# Altium schematic sheet Voltage_Reference_Circuit.SchDoc
size 431 x 279 mm; Organization: ORGANIZATION; Address1: ADDRESS 1; Address2: ADDRESS 2; Address3: ADDRESS 3; Address4: ADDRESS 4; Revision: -; SheetNumber: 5; SheetTotal: 6; ENG_APP_DATE: --/--/--; DSN_APP_DATE: --/--/--; CHK_APP_DATE: --/--/--
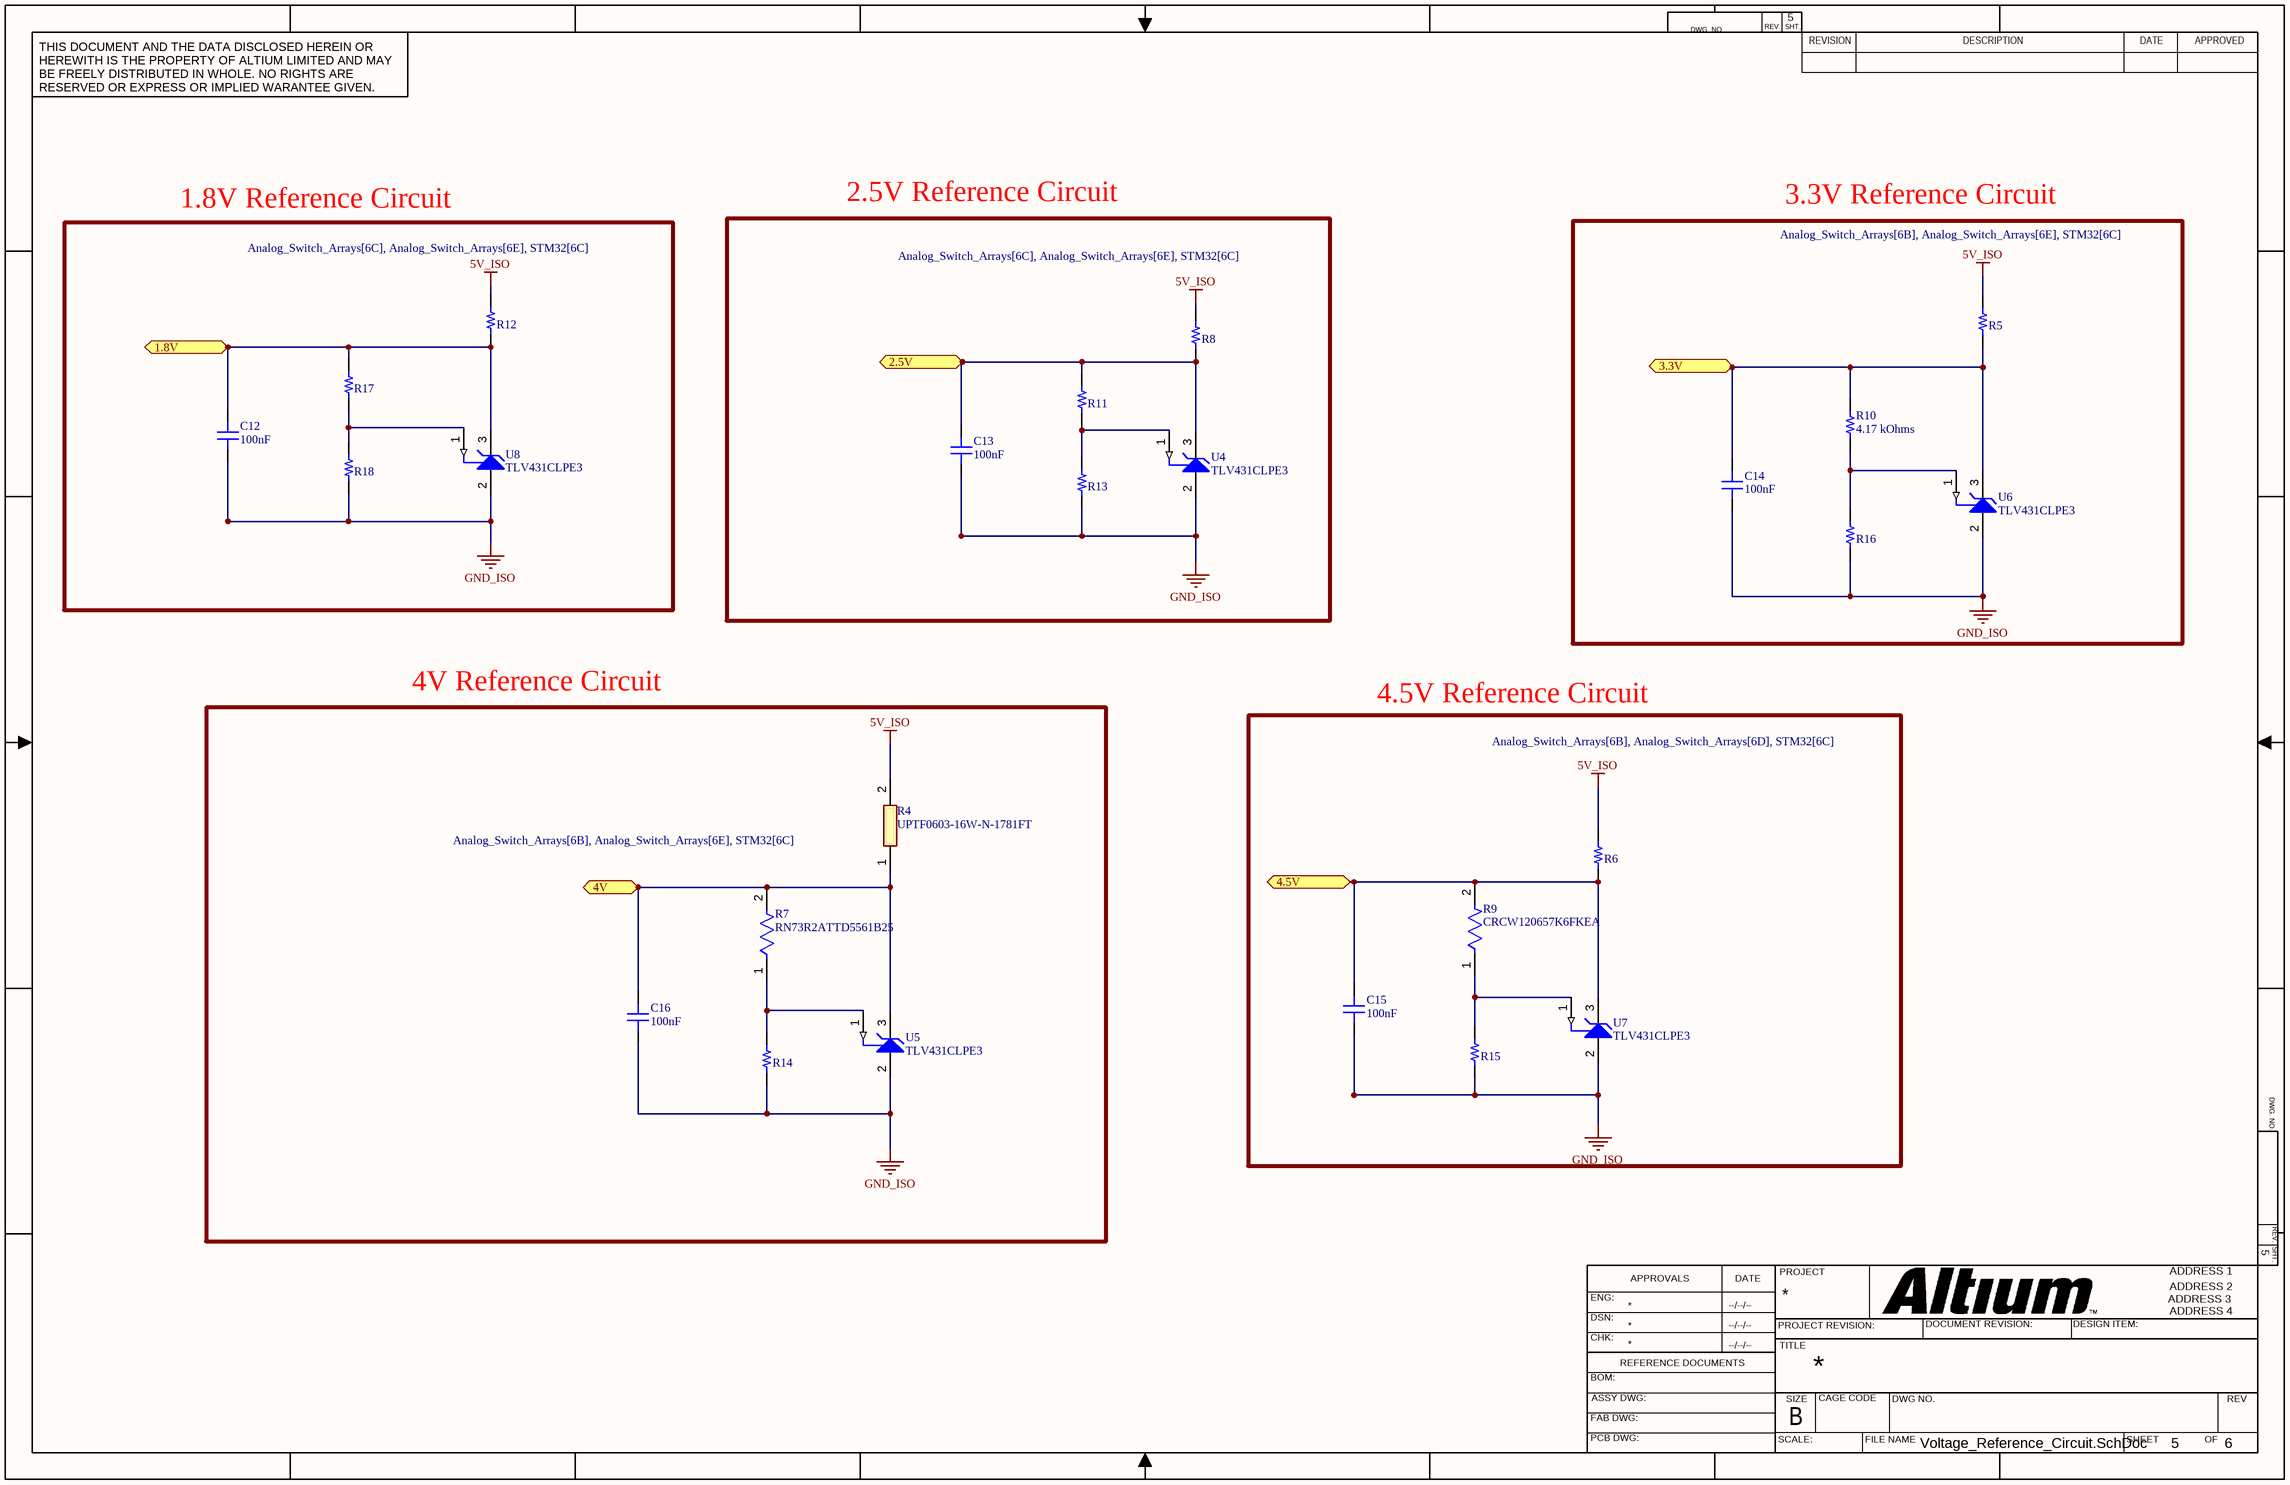
[diagram p0: Voltage_Reference_Circuit.SchDoc]

## Parts
C12  value 100nF  [CAP 1206_3216 - 0.8MM]  (hidden comment: VJ1206Y104KXXAC)
C13  value 100nF  [CAP 1206_3216 - 0.8MM]  (hidden comment: VJ1206Y104KXXAC)
C14  value 100nF  [CAP 1206_3216 - 0.8MM]  (hidden comment: VJ1206Y104KXXAC)
C15  value 100nF  [CAP 1206_3216 - 0.8MM]  (hidden comment: VJ1206Y104KXXAC)
C16  value 100nF  [CAP 1206_3216 - 0.8MM]  (hidden comment: VJ1206Y104KXXAC)
R4  UPTF0603-16W-N-1781FT  [RESC1608X55N]
R5  RQ73C2B1K69BTD  [RES 1206_3216]  (value not drawn)
R6  RT1206BRD07442RL  [YAGEO RES 1206_3216]  (value not drawn)
R7  RN73R2ATTD5561B25  [FP-RN73R2A-IPC_C]
R8  KTR18EZPF2491  [RES 1206_3216]  (value not drawn)
R9  CRCW120657K6FKEA  [FP-CRCW1206-e3-IPC_B]
R10  value 4.17 kOhms  [KOA RES RK73 RN73 0603_1608]  (hidden comment: RN73R1JTTD4171B25)
R11  RT1206BRD072K55L  [YAGEO RES 1206_3216]  (value not drawn)
R12  KTR18EZPF2491  [RES 1206_3216]  (value not drawn)
R13  KTR18EZPF2491  [RES 1206_3216]  (value not drawn)
R14  KTR18EZPF2491  [RES 1206_3216]  (value not drawn)
R15  KTR18EZPF2491  [RES 1206_3216]  (value not drawn)
R16  KTR18EZPF2491  [RES 1206_3216]  (value not drawn)
R17  RK73H2BTTD1131F  [RES 1206_3216]  (value not drawn)
R18  KTR18EZPF2491  [RES 1206_3216]  (value not drawn)
U4  TLV431CLPE3  [TI-LP3]
U5  TLV431CLPE3  [TI-LP3]
U6  TLV431CLPE3  [TI-LP3]
U7  TLV431CLPE3  [TI-LP3]
U8  TLV431CLPE3  [TI-LP3]

## Blocks framed on the sheet
2.5V Reference Circuit: C13 R8 R11 R13 U4
1.8V Reference Circuit: C12 R12 R17 R18 U8
3.3V Reference Circuit: C14 R5 R10 R16 U6
4V Reference Circuit: C16 R4 R7 R14 U5
4.5V Reference Circuit: C15 R6 R9 R15 U7

## Ports
1.8V (bidir, see Analog_Switch_Arrays[6C], Analog_Switch_Arrays[6E], STM32[6C]), 2.5V (bidir, see Analog_Switch_Arrays[6C], Analog_Switch_Arrays[6E], STM32[6C]), 3.3V (bidir, see Analog_Switch_Arrays[6B], Analog_Switch_Arrays[6E], STM32[6C]), 4.5V (bidir, see Analog_Switch_Arrays[6B], Analog_Switch_Arrays[6D], STM32[6C]), 4V (bidir, see Analog_Switch_Arrays[6B], Analog_Switch_Arrays[6E], STM32[6C])

## Nets
5V_ISO: R4.2 R5.2 R6.2 R8.2 R12.2
GND_ISO: C12.1 C13.1 C14.1 C15.1 C16.1 R13.1 R14.1 R15.1 R16.1 R18.1 U4.2(ANODE) U5.2(ANODE) U6.2(ANODE) U7.2(ANODE) U8.2(ANODE)
1.8V: C12.2 R12.1 R17.2 U8.3(CATHODE) ; port 1.8V
2.5V: C13.2 R8.1 R11.2 U4.3(CATHODE) ; port 2.5V
3.3V: C14.2 R5.1 R10.2 U6.3(CATHODE) ; port 3.3V
4.5V: C15.2 R6.1 R9.2 U7.3(CATHODE) ; port 4.5V
4V: C16.2 R4.1 R7.2 U5.3(CATHODE) ; port 4V
NetR7_1: R7.1 R14.2 U5.1(REF)
NetR9_1: R9.1 R15.2 U7.1(REF)
NetR10_1: R10.1 R16.2 U6.1(REF)
NetR11_1: R11.1 R13.2 U4.1(REF)
NetR17_1: R17.1 R18.2 U8.1(REF)

## Notes on the sheet
- DWG. NO.
- REV.
- SHT.
- THIS DOCUMENT AND THE DATA DISCLOSED HEREIN OR HEREWITH IS THE PROPERTY OF ALTIUM LIMITED AND MAY BE FREELY DISTRIBUTED IN WHOLE. NO RIGHTS ARE RESERVED OR EXPRESS OR IMPLIED WARANTEE GIVEN.
- REVISION
- DESCRIPTION
- DATE
- APPROVED
- ENG:
- APPROVALS
- PROJECT
- DSN:
- CHK:
- REFERENCE DOCUMENTS
- PROJECT REVISION:
- TITLE
- DOCUMENT REVISION:
- DESIGN ITEM:
- BOM:
- FAB DWG:
- PCB DWG:
- ASSY DWG:
- SCALE:
- SIZE
- B
- CAGE CODE
- FILE NAME
- DWG NO.
- SHEET
- OF
- REV

## Library data of the parts
C12-C16 = CMP-001-062189-1: CAP CER 0.1UF 25V X7R 1206; Part Number: VJ1206Y104KXXAC
R4 = UPTF0603-16W-N-1781FT: Resistor; Manufacturer_Name: Venkel; Datasheet Link: https://page.venkel.com/hubfs/Resources/Datasheets/UPTF-Series.pdf; Height: 0.55mm; Manufacturer_Part_Number: UPTF0603-16W-N-1781FT
R5 = CMP-009-075815-1: RES 1.69 KOHMS 0.1% 0.4W 1206; Part Number: RQ73C2B1K69BTD
R6 = CMP-009-090039-1: RES SMD 442 OHM 0.1% 1/4W 1206; Part Number: RT1206BRD07442RL
R7 = CMP-04015-006256-1: 5.56kΩ ±0.1% 0.125W, 1/8W Chip Resistor 0805 (2012 Metric) Moisture Resistant Thin Film
R8 R12-R16 R18 = CMP-009-080149-1: RES SMD 2.49K OHM 1% 1/4W 1206; Part Number: KTR18EZPF2491
R9 = CMP-2003-02290-2: RES Thick Film, 57.6kΩ, 1%, 0.25W, 100ppm/°C, 1206; Resistance: 57.6kR; Power Rating: 250mW; Voltage Rating: 200V; Number of Pins: 2; Case/Package: 1206; Max Operating Temperature: 155°C; Min Operating Temperature: -55°C; Case Code (Imperial): 1206; Case Code (Metric): 3216; Temperature Coefficient: 100ppm/°C; Features: Automotive AEC-Q200; Packaging: Tape and Reel; Number of Terminations: 2; Military Standard: Not; Length: 3.2mm; Weight: 0.000353oz; Height: 0.55mm; Width: 0.063inch; Height - Seated (Max): 0.024inch; Voltage Rating (DC): 200V; Radiation Hardening: No; Composition: Thick Film; Package Quantity: 5000; Contact Plating: Tin; Tolerance: 1%; Lead Free: Lead Free; Max Power Dissipation: 250mW; Depth: 1.6mm
R10 = CMP-009-044138-1: RES 4.17K OHM 0.1% 1/10W 0603; Part Number: RN73R1JTTD4171B25
R11 = CMP-009-083477-1: RES SMD 2.55K OHM 0.1% 1/4W 1206; Part Number: RT1206BRD072K55L
R17 = CMP-009-082226-1: RES 1.13K OHM 1% 1/4W 1206; Part Number: RK73H2BTTD1131F
U4-U8 = CMP-0366-00210-1: Low Voltage Adjustable Precision Shunt Regulator, 39 ppm / degC, 15 mA, 0 to 70 degC, 3-pin TO-92 (LP), Pb-Free (RoHS); Manufacturer: Texas Instruments; Eco-Plan: Green (RoHS & no Sb/Br); Iout/Iz(Max)(mA): 15; VO Adj(Max)(V): 6; Min Iz for Regulation(uA): 80; SubFamily: Shunt Voltage Reference; VO Adj(Min)(V): 1.24; Rating: Catalog; Temp Coeff(Typ)(ppm/ degree C): 39; Initial Accuracy @ 25/deg C(%): 1.5; Temp Coeff(Max)(ppm/ degree C): 129; PackageReference: LP3; PackageDescription: Plastic Cylindrical Package, Formed Lead Option (TO-92); ComponentLink2URL: http://www.ti.com/general/docs/lit/getliterature.tsp?genericPartNumber=TLV431&fileType=pdf; ComponentLink2Description: Datasheet; ComponentLink3Description: Package Specification; ComponentLink1URL: http://www.ti.com/; PartNumber: TLV431CLPE3; PackageVersion: 4040001-2/C; Code_JEDEC: TO-226; ComponentLink3URL: http://www.ti.com/litv/pdf/msot002a; DatasheetVersion: SLVS139T; ComponentLink1Description: Manufacturer URL; Mounting Technology: Through Hole